# EAGLE design schematics (EAGLE 9.6.2)
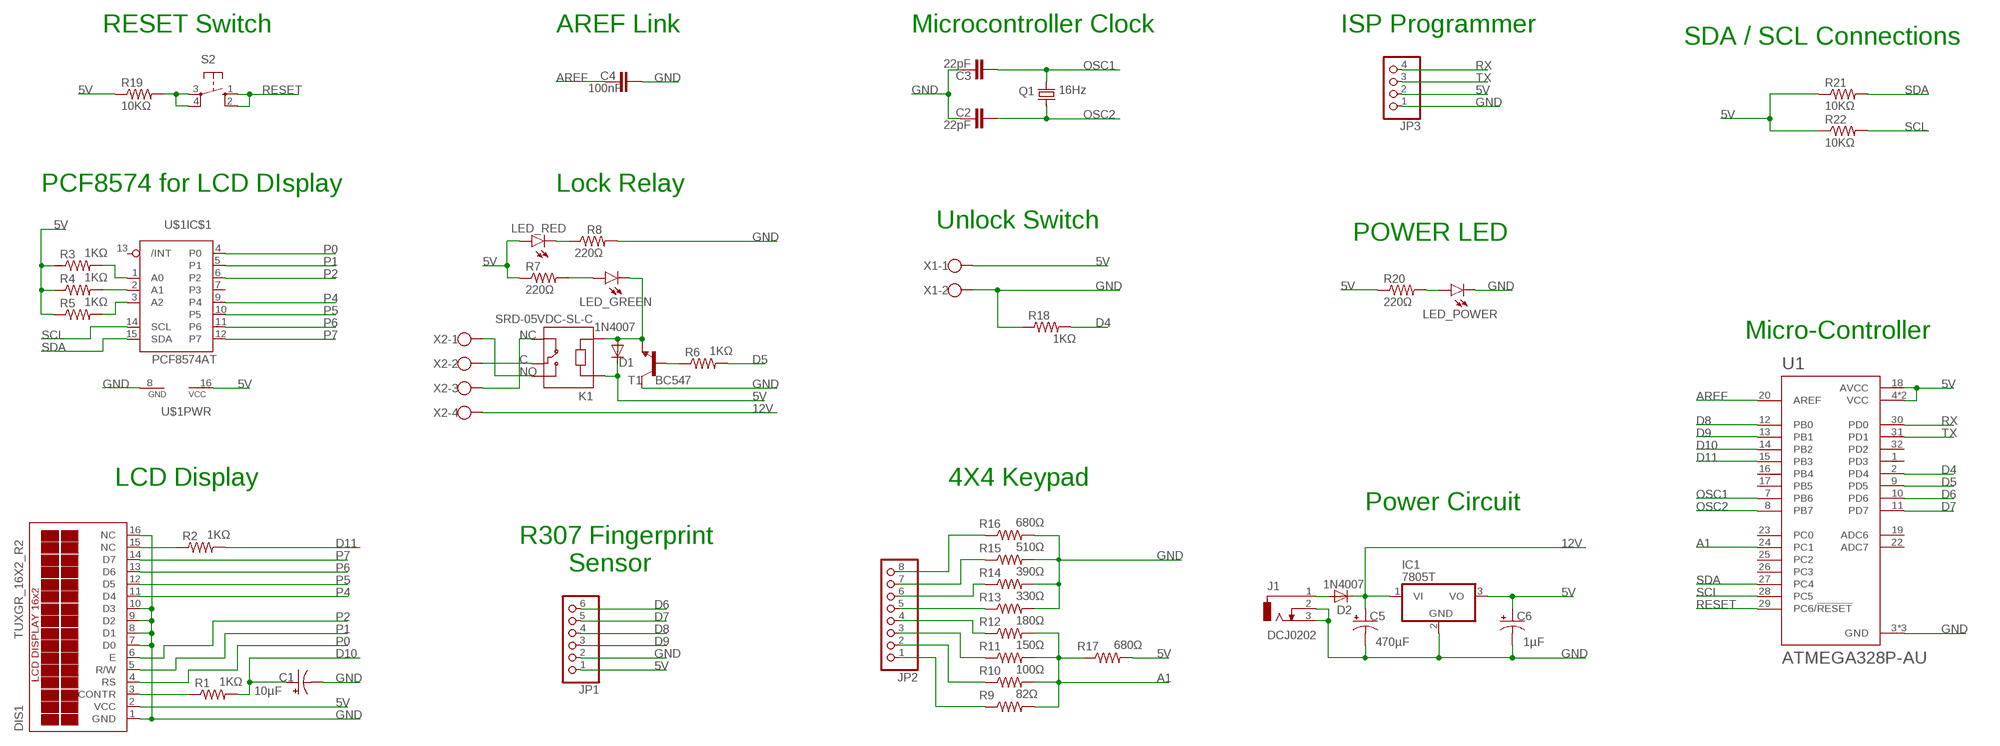
[diagram p0: schematic, sheet 1]

## Parts
C1  10µF  CPOL-US175TMP-0810  [175TMP-0810]
C2  22pF  C-EUC0805  [C0805]
C3  22pF  C-EUC0805  [C0805]
C4  100nF  C-EUC0805  [C0805]
C5  470µF  CPOL-US175TMP-0810  [175TMP-0810]
C6  1µF  CPOL-US175TMP-0810  [175TMP-0810]
D1  1N4007  [SMA]
D2  1N4007  [SMA]
DIS1  TUXGR_16X2_R2  [TUXGR_16X2_R2]
IC1  7805T  [TO220H]
J1  DCJ0202  [DCJ0202]
JP1  PINHD-1X6  [1X06]
JP2  PINHD-1X8  [1X08]
JP3  PINHD-1X4  [1X04]
K1  SRD-05VDC-SL-C  [RELAY_SRD-05VDC-SL-C]
LED_GREEN  LEDCHIPLED_0805  [CHIPLED_0805]
LED_POWER  LEDCHIPLED_0805  [CHIPLED_0805]
LED_RED  LEDCHIPLED_0805  [CHIPLED_0805]
Q1  16Hz  CRYSTALHC49S  [HC49/S]
R1  1KΩ  R-US_R0805  [R0805]
R2  1KΩ  R-US_R0805  [R0805]
R3  1KΩ  R-US_R0805  [R0805]
R4  1KΩ  R-US_R0805  [R0805]
R5  1KΩ  R-US_R0805  [R0805]
R6  1KΩ  R-US_R0805  [R0805]
R7  220Ω  R-US_R0805  [R0805]
R8  220Ω  R-US_R0805  [R0805]
R9  82Ω  R-US_R0805  [R0805]
R10  100Ω  R-US_R0805  [R0805]
R11  150Ω  R-US_R0805  [R0805]
R12  180Ω  R-US_R0805  [R0805]
R13  330Ω  R-US_R0805  [R0805]
R14  390Ω  R-US_R0805  [R0805]
R15  510Ω  R-US_R0805  [R0805]
R16  680Ω  R-US_R0805  [R0805]
R17  680Ω  R-US_R0805  [R0805]
R18  1KΩ  R-US_R0805  [R0805]
R19  10KΩ  R-US_R0805  [R0805]
R20  220Ω  R-US_R0805  [R0805]
R21  10KΩ  R-US_R0805  [R0805]
R22  10KΩ  R-US_R0805  [R0805]
S2  10-XX  [B3F-10XX]
T1  BC547  [TO92]
U1  ATMEGA328P-AU  [QFP80P900X900X120-32N]
U$1  PCF8574AT  [SO16]
X1  W237-102  [W237-102]
X2  W237-4  [W237-4]

## Nets
5V: C6.+ D1.K(C) DIS1.2(VCC) IC1.3(VO) JP1.1 JP3.2 K1.A1 LED_RED.A R3.1 R4.1 R5.1 R7.1 R17.2 R19.1 R20.1 R21.1 R22.1 U1.4(VCC) U1.6(VCC) U1.18(AVCC) U$1.16(PWR:VCC) X1.1
12V: C5.+ D2.K(C) IC1.1(VI) X2.4
A1: R9.2 R10.2 R11.2 R12.2 R17.1 U1.24(PC1)
AREF: C4.2 U1.20(AREF)
C: K1.COM X2.2
D4: R18.2 U1.2(PD4)
D5: R6.2 U1.9(PD5)
D6: JP1.6 U1.10(PD6)
D7: JP1.5 U1.11(PD7)
D8: JP1.4 U1.12(PB0)
D9: JP1.3 U1.13(PB1)
D10: C1.+ R1.2 U1.14(PB2)
D11: R2.2 U1.15(PB3)
GND: C1.- C2.2 C3.2 C4.1 C5.- C6.- DIS1.1(GND) DIS1.7(D0) DIS1.8(D1) DIS1.9(D2) DIS1.10(D3) DIS1.16(NC) IC1.2(GND) J1.2 J1.3 JP1.2 JP3.1 LED_POWER.C R8.2 R13.2 R14.2 R15.2 R16.2 R18.1 T1.3(C) U1.3(GND) U1.5(GND) U1.21(GND) U$1.8(PWR:GND) X1.2
N$1: DIS1.3(CONTR) R1.1
N$2: R3.2 U$1.1(IC$1:A0)
N$3: R4.2 U$1.2(IC$1:A1)
N$4: DIS1.15(NC) R2.1
N$5: R5.2 U$1.3(IC$1:A2)
N$6: D1.A K1.A2 LED_GREEN.C T1.1(E)
N$7: R6.1 T1.2(B)
N$8: LED_RED.C R8.1
N$9: LED_GREEN.A R7.2
N$10: JP2.8 R16.1
N$11: JP2.7 R15.1
N$12: JP2.6 R14.1
N$13: JP2.5 R13.1
N$14: JP2.4 R12.1
N$15: JP2.3 R11.1
N$16: JP2.2 R10.1
N$17: JP2.1 R9.1
N$18: R19.2 S2.3(P) S2.4(P1)
N$19: LED_POWER.A R20.2
N$20: D2.A J1.1
NC: K1.NC X2.3
NO: K1.NO X2.1
OSC1: C3.1 Q1.2 U1.7(PB6)
OSC2: C2.1 Q1.1 U1.8(PB7)
P0: DIS1.4(RS) U$1.4(IC$1:P0)
P1: DIS1.5(R/W) U$1.5(IC$1:P1)
P2: DIS1.6(E) U$1.6(IC$1:P2)
P4: DIS1.11(D4) U$1.9(IC$1:P4)
P5: DIS1.12(D5) U$1.10(IC$1:P5)
P6: DIS1.13(D6) U$1.11(IC$1:P6)
P7: DIS1.14(D7) U$1.12(IC$1:P7)
RESET: S2.1(S) S2.2(S1) U1.29(PC6/!RESET)
RX: JP3.4 U1.30(PD0)
SCL: R22.2 U1.28(PC5) U$1.14(IC$1:SCL)
SDA: R21.2 U1.27(PC4) U$1.15(IC$1:SDA)
TX: JP3.3 U1.31(PD1)
Unconnected: U1.1(PD3) U1.16(PB4) U1.17(PB5) U1.19(ADC6) U1.22(ADC7) U1.23(PC0) U1.25(PC2) U1.26(PC3) U1.32(PD2) U$1.7(IC$1:P3) U$1.13(IC$1:/INT)

## Notes on the sheet
- RESET Switch | AREF Link | Microcontroller Clock | ISP Programmer
- SDA / SCL Connections
- PCF8574 for LCD DIsplay | Lock Relay
- Unlock Switch
- POWER LED
- Micro-Controller
- LCD Display | 4X4 Keypad
- Power Circuit
- R307 Fingerprint 
         Sensor

## Library data of the parts
C1 C5 C6 = rcl:CPOL-US: POLARIZED CAPACITOR, American symbol; SPICEPREFIX: C
C2-C4 = rcl:C-EU: CAPACITOR, European symbol; SPICEPREFIX: C
D1 D2 = casovac:1N4007
DIS1 = display-lcd:TUXGR_16X2_R2: Tuxgraphics LCD display 16x2 characters reflective, without background light Source: tuxgr_12x2_r2.pdf; OC_FARNELL: unknown; OC_NEWARK: unknown
IC1 = linear:78*: Positive VOLTAGE REGULATOR Source: http://cache.national.com/ds/LM/LM78L05.pdf http://www.fairchildsemi.com/ds/LM/LM7805.pdf
J1 = con-jack:DCJ0202: DC POWER JACK Source: DCJ0202.pdf; OC_FARNELL: unknown; OC_NEWARK: unknown
JP1 = pinhead:PINHD-1X6: PIN HEADER
JP2 = pinhead:PINHD-1X8: PIN HEADER
JP3 = pinhead:PINHD-1X4: PIN HEADER
K1 = SRD-05VDC-SL-C:SRD-05VDC-SL-C: 5V Trigger Relay Module For Arduino And Raspberry Pi 5V Trigger Relay Module For Arduino And Raspberry Pi Check prices <https://pricing.snapeda.com/parts/SRD-05VDC-SL-C/Songle%20Relay/view-part?ref=eda>; AVAILABILITY: No availability data; DESCRIPTION: 5V Trigger Relay Module For Arduino And Raspberry Pi 5V Trigger Relay Module For Arduino And Raspberry Pi; MF: Songle Relay; MP: SRD-05VDC-SL-C; PACKAGE: None; PRICE: None
LED_GREEN LED_POWER LED_RED = led:LED: LED OSRAM: - CHIPLED LG R971, LG N971, LY N971, LG Q971, LY Q971, LO R971, LY R971 LH N974, LH R974 LS Q976, LO Q976, LY Q976 LO Q996 - Hyper CHIPLED LW Q18S LB Q993, LB Q99A, LB R99A - SideLED LS A670, LO A670, LY A670, LG A670, LP A670 LB A673, LV A673, LT A673, LW A673 LH A674 LY A675 LS A676, LA A676, LO A676, LY A676, LW A676 LS A679, LY A679, LG A679 - Hyper Micro SIDELED® LS Y876, LA Y876, LO Y876, LY Y876 LT Y87S - SmartLED LW L88C, LW L88S LB L89C, LB L89S, LG L890 LS L89K, LO L89K, LY L89K LS L896, LA L896, LO L896, LY L896 - TOPLED LS T670, LO T670, LY T670, LG T670, LP T670 LSG T670, LSP T670, LSY T670, LOP T670, LYG T670 LG T671, LOG T671, LSG T671 LB T673, LV T673, LT T673, LW T673 LH T674 LS T676, LA T676, LO T676, LY T676, LB T676, LH T676, LSB T676, LW T676 LB T67C, LV T67C, LT T67C, LS T67K, LO T67K, LY T67K, LW E67C LS E67B, LA E67B, LO E67B, LY E67B, LB E67C, LV E67C, LT E67C LW T67C LS T679, LY T679, LG T679 LS T770, LO T770, LY T770, LG T770, LP T770 LB T773, LV T773, LT T773, LW T773 LH T774 LS E675, LA E675, LY E675, LS T675 LS T776, LA T776, LO T776, LY T776, LB T776 LHGB T686 LT T68C, LB T68C - Hyper Mini TOPLED® LB M676 - Mini TOPLED Santana® LG M470 LS M47K, LO M47K, LY M47K Source: http://www.osram.convergy.de LUXEON: - LUMILED® LXK2-PW12-R00, LXK2-PW12-S00, LXK2-PW14-U00, LXK2-PW14-V00 LXK2-PM12-R00, LXK2-PM12-S00, LXK2-PM14-U00 LXK2-PE12-Q00, LXK2-PE12-R00, LXK2-PE12-S00, LXK2-PE14-T00, LXK2-PE14-U00 LXK2-PB12-K00, LXK2-PB12-L00, LXK2-PB12-M00, LXK2-PB14-N00, LXK2-PB14-P00, LXK2-PB14-Q00 LXK2-PR12-L00, LXK2-PR12-M00, LXK2-PR14-Q00, LXK2-PR14-R00 LXK2-PD12-Q00, LXK2-PD12-R00, LXK2-PD12-S00 LXK2-PH12-R00, LXK2-PH12-S00 LXK2-PL12-P00, LXK2-PL12-Q00, LXK2-PL12-R00 Source: www.luxeon.com KINGBRIGHT: KA-3528ASYC Source: www.kingbright.com
Q1 = crystal:CRYSTAL: CRYSTAL; OC_FARNELL: 1667008; OC_NEWARK: unknown
R1-R22 = resistor:R-US_: RESISTOR, American symbol
S2 = switch-omron:10-XX: OMRON SWITCH; MPN: B3F-1000; OC_FARNELL: 176432; OC_NEWARK: 36M3542
T1 = transistor:BC547: NPN TRANSISTOR
U1 = ATMEGA328P-AU:ATMEGA328P-AU: ATmega Series 20 MHz 32 KB Flash 2 KB SRAM 8-Bit Microcontroller - TQFP-32 Check prices <https://pricing.snapeda.com/parts/ATMEGA328P-AU/Microchip%20Technology/view-part?ref=eda>; AVAILABILITY: In Stock; DESCRIPTION: AVR AVR® ATmega Microcontroller IC 8-Bit 20MHz 32KB (16K x 16) FLASH 32-TQFP (7x7); MF: Microchip Technology; MP: ATMEGA328P-AU; PACKAGE: TQFP-32 Microchip; PRICE: None
U$1 = i2c:PCF8574: Remote 8-Bit I/O Expander for I²C Bus
X1 = con-wago-500:W237-102: WAGO SCREW CLAMP; MPN: 237-102; OC_FARNELL: unknown; OC_NEWARK: 70K9898
X2 = con-wago-500:W237-4: WAGO SCREW CLAMP; OC_FARNELL: unknown; OC_NEWARK: unknown

## Board
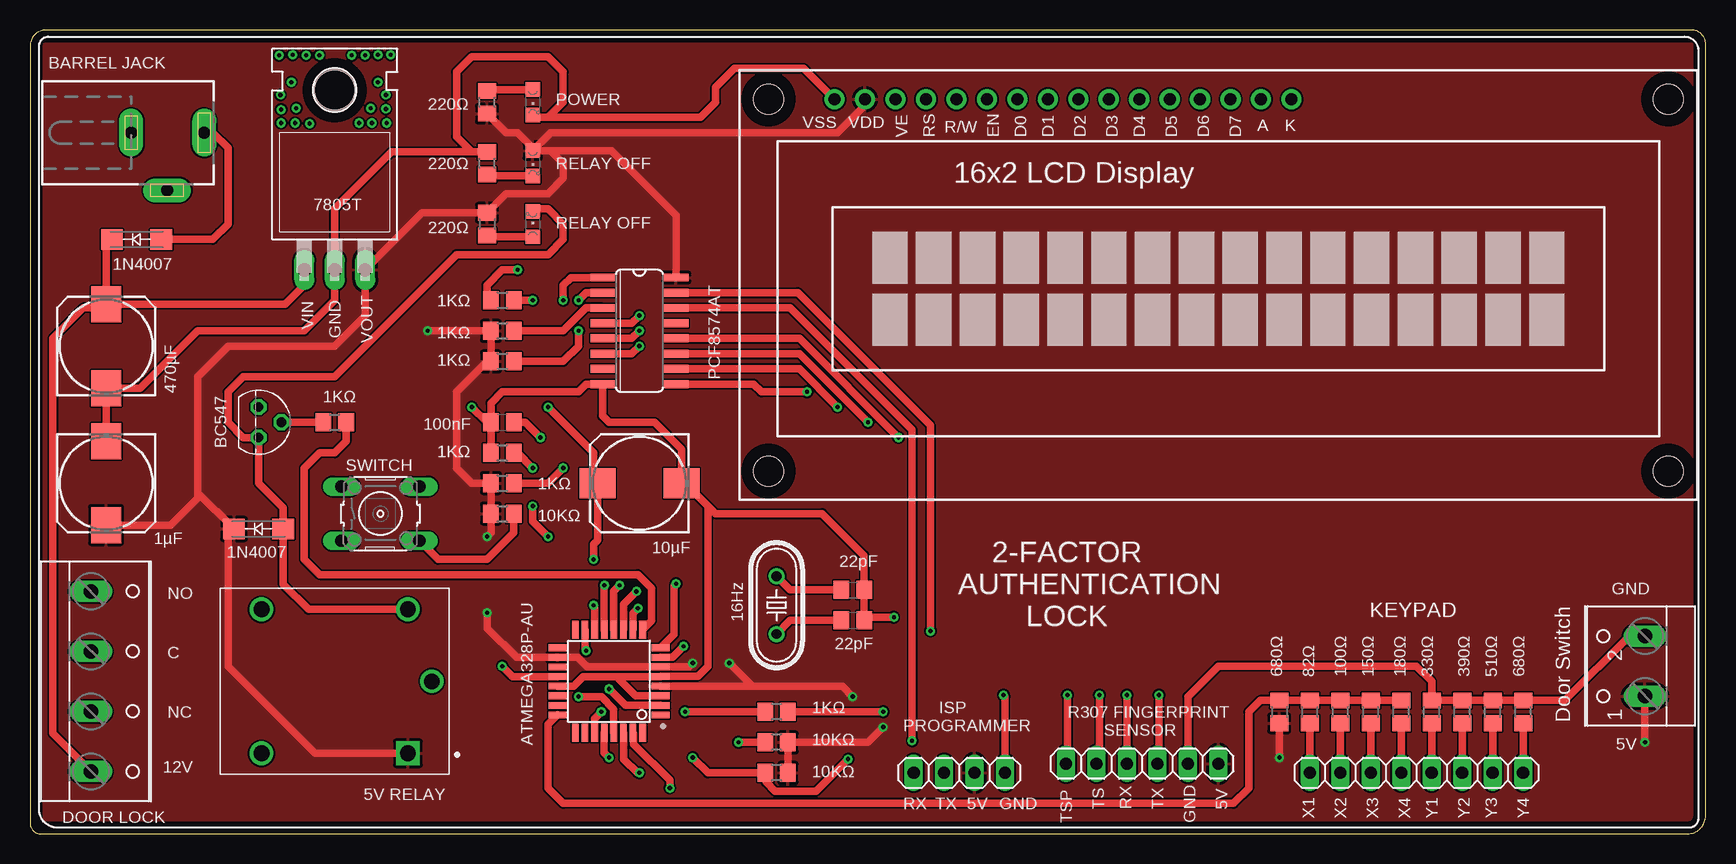
[diagram p1: board, top side]
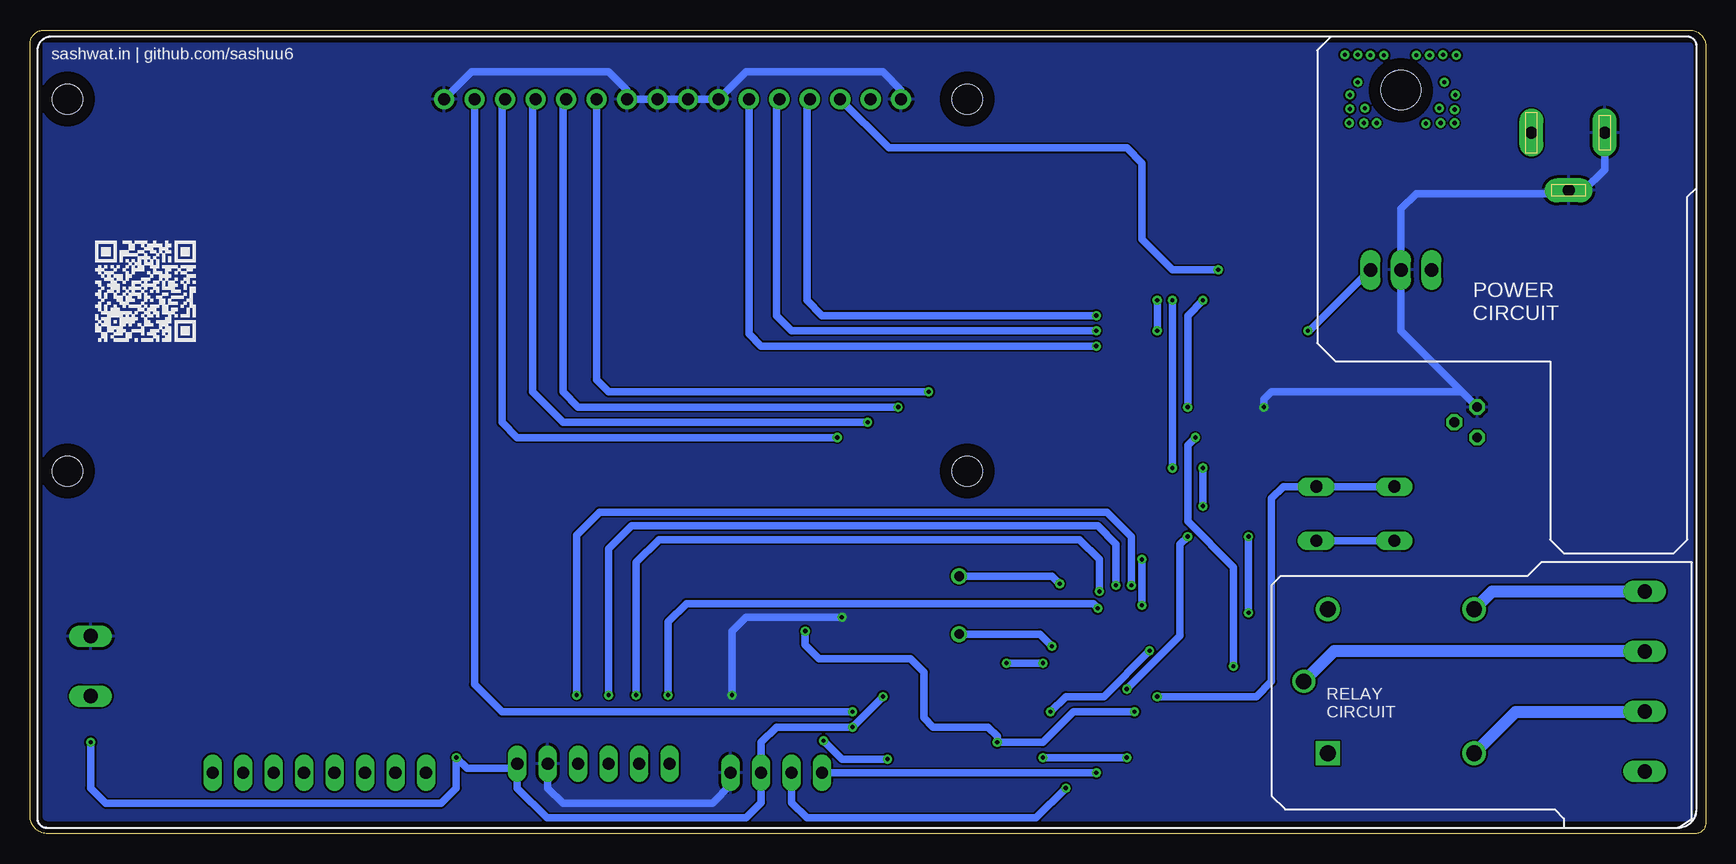
[diagram p2: board, bottom side, seen from below]

Size 139.68 x 66.98 mm. Coordinates in mm from the lower left corner, seen from the top.
Outline: 0,65.66 0,0.89 arc90 0.89,0 138.18,0 arc90 139.68,1.5 139.68,65.81 arc90 138.51,66.98 1.32,66.98 arc90 0,65.66
Copper layers (1*16): Top 0.035mm / dielectric 1.5mm / Bottom 0.035mm
Design rules "default": minimum track width 6mil, minimum drill 0.35mm, track to track 6mil, track to pad 6mil, pad to pad 6mil, via to via 6mil, smd to smd 6mil, copper to edge 40mil, drill to drill 6mil, minimum pad ring 10mil, minimum via ring 8mil, stop-mask expansion 4mil, vias tented up to drill 0mil, thermal gap 10mil

### Footprints (pad centres in the part's own frame; a part is rotated, then mirrored left to right if it is on the bottom)
175TMP-0810 = smd 3 x 2.5: + 3.5,0; - -3.5,0
C0805 = smd 1.3 x 1.5: 1 -0.95,0; 2 0.95,0
SMA = smd 1.8 x 1.7: A -2.05,0; K 2.05,0
TUXGR_16X2_R2 = drill 1 pad 1.676: 1 -32,15.5; 2 -29.46,15.5; 3 -26.92,15.5; 4 -24.38,15.5; 5 -21.84,15.5; 6 -19.3,15.5; 7 -16.76,15.5; 8 -14.22,15.5; 9 -11.68,15.5; 10 -9.14,15.5; 11 -6.6,15.5; 12 -4.06,15.5; 13 -1.52,15.5; 14 1.02,15.5; 15 3.56,15.5; 16 6.1,15.5 | hole 2.5: -37.5,-15.5; 37.5,-15.5; -37.5,15.5; 37.5,15.5
TO220H = drill 1.118 long: 1 -2.54,-10.16; 2 0,-10.16; 3 2.54,-10.16 | hole 3.302: 0,4.826
DCJ0202 = drill 1 pad 2 long: 1 0,3.1; 2 4.8,0; 3 0,-3
1X06 = drill 1.016 long: 1 -6.35,0; 2 -3.81,0; 3 -1.27,0; 4 1.27,0; 5 3.81,0; 6 6.35,0
1X08 = drill 1.016 long: 1 -8.89,0; 2 -6.35,0; 3 -3.81,0; 4 -1.27,0; 5 1.27,0; 6 3.81,0; 7 6.35,0; 8 8.89,0
1X04 = drill 1.016 long: 1 -3.81,0; 2 -1.27,0; 3 1.27,0; 4 3.81,0
RELAY_SRD-05VDC-SL-C = drill 1.32 square: A1 -6.1,6 | drill 1.32: A2 -6.1,-6; NC 6.1,6; NO 6.1,-6 | drill 1.29: COM -8.1,0
CHIPLED_0805 = smd 1.2 x 1.2: A 0,-1.05; C 0,1.05
HC49/S = drill 0.813: 1 -2.413,0; 2 2.413,0
R0805 = smd 1.3 x 1.5: 1 -0.95,0; 2 0.95,0
B3F-10XX = drill 1.016 long: 1 -3.251,2.261; 2 3.251,2.261; 3 -3.251,-2.261; 4 3.251,-2.261
TO92 = drill 0.813 octagon: 1 1.27,0; 2 0,1.905; 3 -1.27,0
QFP80P900X900X120-32N = smd 1.5 x 0.55: 1 -4.3,2.8; 2 -4.3,2; 3 -4.3,1.2; 4 -4.3,0.4; 5 -4.3,-0.4; 6 -4.3,-1.2; 7 -4.3,-2; 8 -4.3,-2.8; 17 4.3,-2.8; 18 4.3,-2; 19 4.3,-1.2; 20 4.3,-0.4; 21 4.3,0.4; 22 4.3,1.2; 23 4.3,2; 24 4.3,2.8 | smd 0.55 x 1.5: 9 -2.8,-4.3; 10 -2,-4.3; 11 -1.2,-4.3; 12 -0.4,-4.3; 13 0.4,-4.3; 14 1.2,-4.3; 15 2,-4.3; 16 2.8,-4.3; 25 2.8,4.3; 26 2,4.3; 27 1.2,4.3; 28 0.4,4.3; 29 -0.4,4.3; 30 -1.2,4.3; 31 -2,4.3; 32 -2.8,4.3
SO16 = smd 0.66 x 2.032: 1 -4.445,-3.073; 2 -3.175,-3.073; 3 -1.905,-3.073; 4 -0.635,-3.073; 5 0.635,-3.073; 6 1.905,-3.073; 7 3.175,-3.073; 8 4.445,-3.073; 9 4.445,3.073; 10 3.175,3.073; 11 1.905,3.073; 12 0.635,3.073; 13 -0.635,3.073; 14 -1.905,3.073; 15 -3.175,3.073; 16 -4.445,3.073
W237-102 = drill 1.194 long: 1 -2.5,-1.27; 2 2.5,-1.27
W237-4 = drill 1.194 long: 1 -7.5,-1.27; 2 -2.5,-1.27; 3 2.5,-1.27; 4 7.5,-1.27

### Placement (x,y rotation side)
C1  50.8,29.21 180 top
C2  68.58,20.32 0 top
C3  68.58,17.78 0 top
C4  39.37,34.29 0 top
C5  6.35,40.64 90 top
C6  6.35,29.21 270 top
D1  19.05,25.4 180 top
D2  8.89,49.53 180 top
DIS1  99.06,45.72 0 top
IC1  25.4,57.15 0 top
J1  11.43,58.42 270 top
JP1  92.71,5.84 180 top
JP2  115.57,5.08 0 top
JP3  77.47,5.08 180 top
K1  25.4,12.7 180 top
LED_GREEN  41.91,50.8 0 top
LED_POWER  41.91,60.96 180 top
LED_RED  41.91,55.88 180 top
Q1  62.23,19.05 270 top
R1  39.37,44.45 0 top
R2  62.23,10.16 180 top
R3  39.37,29.21 0 top
R4  39.37,39.37 0 top
R5  39.37,41.91 0 top
R6  25.4,34.29 0 top
R7  38.1,50.8 270 top
R8  38.1,55.88 90 top
R9  106.68,10.16 90 top
R10  109.22,10.16 90 top
R11  111.76,10.16 90 top
R12  114.3,10.16 90 top
R13  116.84,10.16 90 top
R14  119.38,10.16 90 top
R15  121.92,10.16 90 top
R16  124.46,10.16 90 top
R17  104.14,10.16 270 top
R18  39.37,31.75 0 top
R19  39.37,26.67 0 top
R20  38.1,60.96 90 top
R21  62.23,7.62 180 top
R22  62.23,5.08 180 top
S2  29.21,26.67 0 top
T1  19.05,34.29 270 top
U1  48.26,12.7 180 top
U$1  50.8,41.91 270 top
X1  133.35,13.97 90 top
X2  6.35,12.7 270 top

### Tracks (layer width: path | path; a pad name or v marks a point on that pad's centre or on a via)
5V  (via drill 0.35)
  Top 0.61: 13.97,28.43 13.97,38.1 16.51,40.64 25.4,40.64 27.94,43.18 IC1.3 32.7,51.75 R7.1 39.69,53.34 43.18,53.34 44.45,54.61 44.45,55.88 43.4,56.93 | 13.97,28.43 13.97,27.94 11.74,25.71 C6.+ | R20.1 39.69,58.42 40.64,58.42 41.91,57.15 LED_RED.A | 43.4,56.93 LED_RED.A | 13.97,28.43 D1.K 16.51,24.91 16.51,13.97 23.78,6.7 K1.A1 | DIS1.2 69.6,60.71 67.31,58.42 43.4,58.42 LED_RED.A | v33.15,41.91 R5.1 R4.1 38.1,39.37 35.56,36.83 35.56,30.48 36.83,29.21 R3.1 R19.1 38.42,25.08 v38.1,24.76 | U$1.16 53.87,51.54 48.48,56.93 43.4,56.93 | X1.1 v134.62,7.62 | R17.2 v104.14,6.35 | R22.1 R21.1 69.85,7.62 v71.12,8.89 | U1.4 60.22,12.3 | v68.58,11.43 67.71,12.3 60.5,12.3 60.22,12.3 | v38.1,18.41 38.1,17.14 40.55,14.7 U1.18 45.62,14.7 46.42,13.9 U1.6 54.92,13.9 v55.24,14.22 | v58.29,14.22 60.22,12.3
  Bottom 0.61: IC1.3 33.02,41.91 v33.15,41.91 | v134.62,7.62 134.62,3.81 133.35,2.54 105.41,2.54 104.14,3.81 v104.14,6.35 103.25,5.46 99.44,5.46 JP1.1 99.06,3.81 96.57,1.32 80.01,1.32 78.74,2.59 JP3.2 78.74,7.62 77.47,8.89 v71.12,8.89 v68.58,11.43 | v38.1,24.76 v38.1,18.41 | v55.24,14.22 v58.29,14.22
  pour Top: 1.52,66.8 arc90 0.38,65.66 0.38,1.27 arc90 1.52,0.13 137.92,0.13 arc90 139.45,1.65 139.45,65.66 arc90 138.3,66.8
12V
  Top 0.61: D2.K 6.35,49.04 C5.+ | IC1.1 22.86,45.72 21.28,44.14 C5.+ | C5.+ 6.03,43.81 4.45,43.81 1.91,41.27 1.91,8.38 X2.4
A1
  Top 0.61: R12.2 R11.2 R10.2 R9.2 R17.1 102.55,11.11 101.6,10.16 101.6,3.81 100.33,2.54 44.45,2.54 43.18,3.81 43.18,9.12 U1.24
AREF  (via drill 0.35)
  Top 0.61: C4.2 41.27,34.29 v42.55,33.02 | U1.20 40.24,13.1 v39.37,13.97
  Bottom 0.61: v42.55,33.02 43.18,32.38 43.18,26.03 39.37,22.22 v39.37,13.97
C
  Bottom 1.016: K1.COM 30.96,15.24 5.12,15.24 X2.2
D4  (via drill 0.35)
  Top 0.61: U1.2 49.62,10.7 v48.26,12.06 | R18.2 40.64,31.75 v41.91,30.48 | v43.18,24.76 41.91,26.03 v41.91,27.3
  Bottom 0.61: v48.26,12.06 43.81,16.51 43.81,24.13 v43.18,24.76 | v41.91,30.48 v41.91,27.3
D5
  Top 0.61: R6.2 26.35,32.7 25.4,31.75 24.13,31.75 22.86,30.48 22.86,22.86 24.13,21.59 50.67,21.59 51.82,20.44 51.82,17.76 U1.9
D6  (via drill 0.35)
  Top 0.61: U1.10 50.26,18.38 v50.67,18.8 | v86.49,11.56 86.49,5.97 JP1.6
  Bottom 0.61: v50.67,18.8 51.05,19.18 84.96,19.18 86.49,17.65 v86.49,11.56
D7  (via drill 0.35)
  Top 0.61: U1.11 49.46,19.11 v50.55,20.19 | v89.15,11.56 89.15,6.1 JP1.5
  Bottom 0.61: v50.55,20.19 50.55,22.86 52.2,24.51 87.25,24.51 89.15,22.61 v89.15,11.56
D8  (via drill 0.35)
  Top 0.61: U1.12 48.66,20.21 v49.15,20.7 | v91.44,11.56 JP1.4
  Bottom 0.61: v49.15,20.7 49.15,24.13 50.67,25.65 89.53,25.65 91.44,23.75 v91.44,11.56
D9  (via drill 0.35)
  Top 0.61: U1.13 47.86,20.68 v47.88,20.7 | v94.11,11.56 94.11,5.97 JP1.3
  Bottom 0.61: v47.88,20.7 47.88,24.76 49.91,26.8 92.2,26.8 94.11,24.89 v94.11,11.56
D10  (via drill 0.35)
  Top 0.61: v41.91,44.45 R1.2 | v43.18,35.56 46.99,31.75 46.99,29.52 C1.+ 47.3,24.44 46.99,24.13 v46.99,22.86 | v46.99,19.05 47.06,18.98 U1.14
  Bottom 0.61: v41.91,44.45 43.18,43.18 v43.18,35.56 | v46.99,22.86 v46.99,19.05
D11  (via drill 0.35)
  Top 0.61: U1.15 46.26,15.24 v46.35,15.24 | R2.2 v54.61,10.16
  Bottom 0.61: v46.35,15.24 50.16,11.43 53.34,11.43 v54.61,10.16
GND  (via drill 0.35)
  Top 0.61: C6.- C5.- 9.2,37.14 13.97,41.91 22.86,41.91 25.4,44.45 IC1.2 25.4,52.07 30.16,56.83 36.83,56.83 | 36.83,56.83 R8.2 | LED_POWER.C 42.13,59.69 43.18,59.69 | 43.18,59.69 44.45,60.96 44.45,63.5 43.18,64.77 36.83,64.77 35.56,63.5 35.56,58.1 36.83,56.83 | 43.18,59.69 55.88,59.69 57.15,60.96 57.15,62.23 58.71,63.79 64.48,63.79 DIS1.1 | C4.1 R18.1 | C4.1 38.42,35.88 39.37,36.83 45.72,36.83 46.35,37.46 U$1.8 47.73,34.82 48.26,34.29 52.07,34.29 54.3,32.06 C1.- 54.61,29.21 56.52,27.3 | 56.52,27.3 57.15,26.67 66.04,26.67 69.53,23.18 C2.2 C3.2 69.78,18.03 v72.01,18.03 | X1.2 133.31,16.47 127.95,11.11 R16.2 R15.2 R14.2 R13.2 116.84,12.7 115.57,13.97 99.06,13.97 96.52,11.43 JP1.2 | C4.1 38.1,34.29 v36.83,35.56 | 48.9,13.1 U1.5 52.6,13.14 55.68,13.14 56.52,13.97 56.52,27.3 | 48.9,13.1 46.12,13.1 45.32,12.3 U1.21 | U1.3 50.49,11.5 48.9,13.1 | JP3.1 81.28,11.43 v81.15,11.56
  Bottom 0.61: J1.3 8.43,55.35 10.16,53.62 J1.2 11.71,53.34 24.13,53.34 25.4,52.07 IC1.2 25.4,41.91 T1.3 20.32,36.83 36.2,36.83 36.83,36.2 v36.83,35.56 | DIS1.16 102.88,63.5 91.44,63.5 89.92,61.98 DIS1.10 DIS1.9 DIS1.8 DIS1.7 80.01,63.5 68.58,63.5 67.06,61.98 DIS1.1 | JP1.2 96.52,3.81 95.25,2.54 82.8,2.54 81.28,4.06 JP3.1 | v72.01,18.03 80.01,18.03 81.15,16.89 v81.15,11.56
  pour Bottom: 20.19,63.37 20.19,65.28 30.48,65.28 30.48,63.37 29.72,63.37 29.72,61.85 30.48,61.85 30.48,58.8 20.19,58.8 20.19,61.85 20.95,61.85 20.95,63.37
  pour Top: 20.19,65.28 30.48,65.28 30.48,63.37 29.72,63.37 29.72,61.85 30.48,61.85 30.48,58.8 20.19,58.8 20.19,61.85 20.95,61.85 20.95,63.37 20.19,63.37
  pour Bottom: 1.52,66.8 arc90 0.38,65.66 0.38,1.27 arc90 1.52,0.13 137.92,0.13 arc90 139.45,1.65 139.45,65.66 arc90 138.3,66.8
N$1  (via drill 0.35)
  Top 0.61: R1.1 38.1,44.77 38.1,45.72 39.37,46.99 v40.64,46.99
  Bottom 0.61: DIS1.3 68.07,57.15 48.26,57.15 46.99,55.88 46.99,49.53 44.45,46.99 v40.64,46.99
N$2  (via drill 0.35)
  Top 0.61: U$1.1 45.09,46.35 44.45,45.72 v44.45,44.45 | v44.45,30.48 43.18,29.21 R3.2
  Bottom 0.61: v44.45,44.45 v44.45,30.48
N$3  (via drill 0.35)
  Top 0.61: R4.2 44.45,39.37 45.72,40.64 v45.72,41.91 | U$1.2 46.35,45.09 v45.72,44.45
  Bottom 0.61: v45.72,44.45 v45.72,41.91
N$4  (via drill 0.35)
  Top 0.61: R2.1 v71.12,10.16
  Bottom 0.61: DIS1.15 102.62,12.45 100.33,10.16 v71.12,10.16
N$5
  Top 0.61: U$1.3 46.35,43.81 44.45,41.91 R5.2
N$6
  Top 0.61: K1.A2 23.21,18.7 21.1,20.81 D1.A 21.1,27.16 19.05,29.21 T1.1 17.78,33.02 16.51,34.29 16.51,36.83 17.78,38.1 25.4,38.1 35.56,48.26 43.18,48.26 44.45,49.53 44.45,50.8 43.18,52.07 42.13,52.07 LED_GREEN.C
N$7
  Top 0.61: R6.1 T1.2
N$8
  Top 0.61: R8.1 38.2,54.83 LED_RED.C
N$9
  Top 0.61: LED_GREEN.A 38.2,49.75 R7.2
N$10
  Top 0.61: R16.1 JP2.8
N$11
  Top 0.61: R15.1 JP2.7
N$12
  Top 0.61: R14.1 JP2.6
N$13
  Top 0.61: R13.1 JP2.5
N$14
  Top 0.61: R12.1 JP2.4
N$15
  Top 0.61: R11.1 JP2.3
N$16
  Top 0.61: R10.1 JP2.2
N$17
  Top 0.61: R9.1 JP2.1
N$18
  Top 0.61: R19.2 40.32,25.08 38.1,22.86 34.01,22.86 S2.4
  Bottom 0.61: S2.4 S2.3
N$19
  Top 0.61: LED_POWER.A 38.2,62.01 R20.2
N$20
  Top 0.61: J1.1 15.24,58.42 16.51,57.15 16.51,50.8 15.24,49.53 D2.A
N$21  (via drill 0.35)
  other vias: 20.78,64.87
N$22  (via drill 0.35)
  other vias: 21.89,64.92
N$23  (via drill 0.35)
  other vias: 23.01,64.87
N$24  (via drill 0.35)
  other vias: 27.94,64.87
N$25  (via drill 0.35)
  other vias: 29.01,64.92
N$26  (via drill 0.35)
  other vias: 30.07,64.92
N$27  (via drill 0.35)
  other vias: 26.82,64.87
N$28  (via drill 0.35)
  other vias: 24.13,64.87
N$29  (via drill 0.35)
  other vias: 20.93,59.23
N$30  (via drill 0.35)
  other vias: 22.1,59.23
N$31  (via drill 0.35)
  other vias: 23.32,59.18
N$32  (via drill 0.35)
  other vias: 27.43,59.23
N$33  (via drill 0.35)
  other vias: 28.5,59.23
N$34  (via drill 0.35)
  other vias: 29.72,59.23
N$35  (via drill 0.35)
  other vias: 29.67,60.4
N$36  (via drill 0.35)
  other vias: 20.93,60.35
N$37  (via drill 0.35)
  other vias: 20.88,61.57
N$38  (via drill 0.35)
  other vias: 29.67,61.57
N$39  (via drill 0.35)
  other vias: 21.79,62.64
N$40  (via drill 0.35)
  other vias: 29.01,62.64
N$41  (via drill 0.35)
  other vias: 22.2,60.45
N$42  (via drill 0.35)
  other vias: 28.4,60.45
NC
  Bottom 1.016: K1.NC 15.84,10.16 5.12,10.16 X2.3
NO
  Bottom 1.016: K1.NO 17.8,20.2 X2.1
OSC1  (via drill 0.35)
  Top 0.61: U1.7 53.56,14.7 v54.48,15.62 | C3.1 63.37,17.78 Q1.2
  Bottom 0.61: Q1.2 55.5,16.64 v54.48,15.62
OSC2  (via drill 0.35)
  Top 0.61: U1.8 53.7,16.64 53.7,20.68 v53.85,20.83 | Q1.1 63.37,20.32 C2.1
  Bottom 0.61: Q1.1 54.48,21.46 v53.85,20.83
P0  (via drill 0.35)
  Top 0.61: U$1.4 50.16,42.54 v50.8,43.18
  Bottom 0.61: v50.8,43.18 73.66,43.18 74.93,44.45 74.93,60.97 DIS1.4
P1  (via drill 0.35)
  Top 0.61: U$1.5 50.16,41.27 v50.8,41.91
  Bottom 0.61: v50.8,41.91 76.2,41.91 77.47,43.18 77.47,60.97 DIS1.5
P2  (via drill 0.35)
  Top 0.61: U$1.6 50.16,40.01 v50.8,40.64
  Bottom 0.61: v50.8,40.64 78.74,40.64 79.76,41.66 DIS1.6
P4  (via drill 0.35)
  Top 0.61: v64.77,36.83 60.96,36.83 60.33,37.46 U$1.9
  Bottom 0.61: DIS1.11 92.46,37.85 91.44,36.83 v64.77,36.83
P5  (via drill 0.35)
  Top 0.61: v67.31,35.56 64.14,38.73 U$1.10
  Bottom 0.61: v67.31,35.56 93.98,35.56 95.25,36.83 95.25,60.97 DIS1.12
P6  (via drill 0.35)
  Top 0.61: U$1.11 64.14,40.01 v69.85,34.29
  Bottom 0.61: v69.85,34.29 95.25,34.29 97.79,36.83 97.79,60.97 DIS1.13
P7  (via drill 0.35)
  Top 0.61: v72.39,33.02 64.14,41.27 U$1.12
  Bottom 0.61: v72.39,33.02 99.06,33.02 100.33,34.29 100.33,60.97 DIS1.14
RESET  (via drill 0.35)
  Top 0.61: U1.29 48.66,10.39 47.62,11.43 v45.72,11.43
  Bottom 0.61: S2.1 S2.2 35.2,28.93 36.2,27.94 36.2,12.7 37.47,11.43 v45.72,11.43
RX  (via drill 0.35)
  Top 0.61: U1.30 49.5,8.36 49.5,6.22 50.64,5.08 v50.8,5.08
  Bottom 0.61: JP3.4 v50.8,5.08
SCL  (via drill 0.35)
  Top 0.61: U1.28 47.86,6.75 v48.26,6.35 | v55.24,6.35 56.52,5.08 R22.2 61.34,5.02 61.34,4.32 62.1,3.56 65.53,3.56 v68.2,6.22 | U$1.14 63.37,43.81 73.53,33.65 v73.53,7.75
  Bottom 0.61: v48.26,6.35 v55.24,6.35 | v73.53,7.75 72.01,6.22 v68.2,6.22
SDA  (via drill 0.35)
  Top 0.61: U1.27 47.06,9.59 v47.62,10.16 | R21.2 v59.05,7.62 | U$1.15 64.01,45.09 75.06,34.04 v75.06,16.89
  Bottom 0.61: v47.62,10.16 52.7,10.16 55.24,7.62 v59.05,7.62 59.05,8.13 59.82,8.89 64.39,8.89 65.15,9.65 65.15,13.46 66.29,14.6 73.91,14.6 75.06,15.75 v75.06,16.89
TX  (via drill 0.35)
  Top 0.61: U1.31 50.33,8.33 50.33,7.46 53.34,4.45 v53.34,3.81
  Bottom 0.61: JP3.3 76.2,2.59 74.93,1.32 55.83,1.32 v53.34,3.81

### Text on the board
tPlace: BARREL JACK | POWER | 220Ω | A | K | VSS | VDD | VE | RS | R/W | EN | D0 | D1 | D2 | D3 | D4 | D5 | D6 | D7 | 220Ω | RELAY OFF | 16x2 LCD Display | 7805T | 220Ω | RELAY OFF | 1N4007 | 1KΩ | VIN | GND | VOUT | 1KΩ | 1KΩ | PCF8574AT | 470µF | 1KΩ | 100nF | BC547 | 1KΩ | SWITCH | 1KΩ | 10KΩ | 1µF | 1N4007 | 10µF | 22pF | NO | GND | 16Hz | KEYPAD | 2-FACTOR / AUTHENTICATION / LOCK | C | 22pF | 680Ω | 82Ω | 100Ω | 150Ω | 180Ω | 330Ω | 390Ω | 510Ω | 680Ω | NC | 1KΩ | ISP / PROGRAMMER | Door Switch | R307 FINGERPRINT / SENSOR | ATMEGA328P-AU | 10KΩ | 5V | 12V | 10KΩ | 5V RELAY | RX | TX | 5V | GND | TS | RX | TX | 5V | DOOR LOCK | TSP | GND | X1 | X2 | X3 | X4 | Y1 | Y2 | Y3 | Y4
bPlace: sashwat.in | github.com/sashuu6 | POWER / CIRCUIT | RELAY / CIRCUIT